# Altium schematic sheet Page-6.schdoc: PCIe-Addon
size 308 x 237 mm; CompanyName: InSYS; DrawnBy: NaveenKumar; Revision: 2.0; SheetNumber: 6; SheetTotal: 10; Title2: Gateway
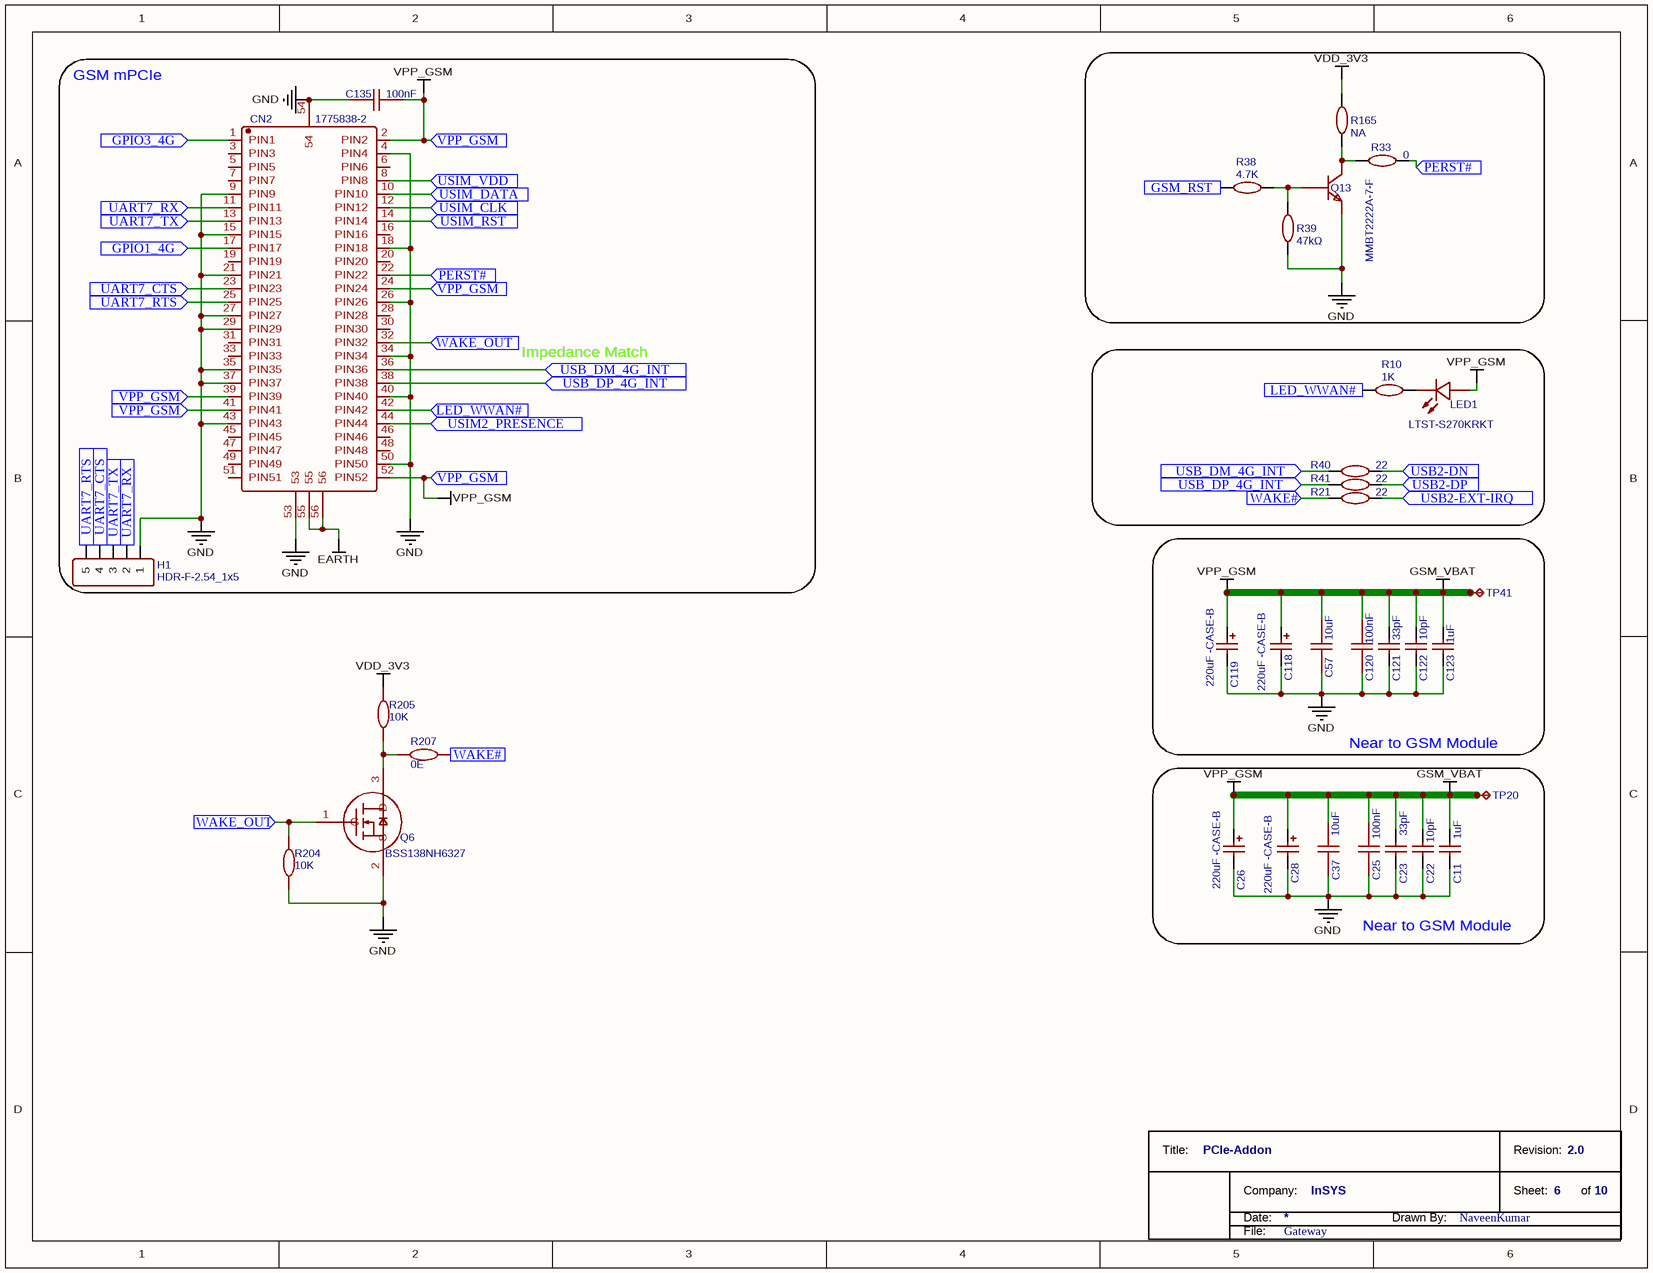
[diagram p0: Page-6.schdoc]

## Parts
*  TitleBlock_1  (value not drawn)  (graphical)
C11  1uF  [GWAY_Capacitor_0603]
C22  10pF  [GWAY_Capacitor_0603]
C23  33pF  [GWAY_Capacitor_0603]
C25  100nF  [GWAY_Capacitor_0603]
C26  220uF -CASE-B  [GWAY_CASE-B]
C28  220uF -CASE-B  [GWAY_CASE-B]
C37  10uF  [GWAY_Capacitor_0805]
C57  10uF  [GWAY_Capacitor_0603]
C118  220uF -CASE-B  [GWAY_CASE-B]
C119  220uF -CASE-B  [GWAY_CASE-B]
C120  100nF  [GWAY_Capacitor_0603]
C121  33pF  [GWAY_Capacitor_0603]
C122  10pF  [GWAY_Capacitor_0603]
C123  1uF  [GWAY_Capacitor_0603]
C135  100nF  [GWAY_Capacitor_0603]
CN2  1775838-2  [GWAY_TE_1775838-2_Full_Card]
H1  HDR-F-2.54_1x5  [GWAY_5way_HEADER_CONN]
LED1  LTST-S270KRKT  [GWAY_Led_WHITE_0603]
Q6  BSS138NH6327  [GWAY_SOT23-3PIN]
Q13  MMBT2222A-7-F  [GWAY_SOT23-3PIN]
R10  1K  [GWAY_Resistor_0603]
R21  22  [GWAY_Resistor_0603]
R33  0  [GWAY_Resistor_0603]
R38  4.7K  [GWAY_Resistor_0603]
R39  47kΩ  [GWAY_Resistor_0603]
R40  22  [GWAY_Resistor_0603]
R41  22  [GWAY_Resistor_0603]
R165  NA  [GWAY_Resistor_0603]
R204  10K  [GWAY_Resistor_0603]
R205  10K  [GWAY_Resistor_0603]
R207  0E  [GWAY_Resistor_0603]
TP20  TP-052-TJ  [GWAY_TESTPOINT1]  (value not drawn)
TP41  TP-052-TJ  [GWAY_TESTPOINT1]  (value not drawn)

## Blocks framed on the sheet
Near to GSM Module: C57 C118-C123 TP41

## Ports
GPIO1_4G (in), GPIO3_4G (in), GSM_RST (in), LED_WWAN# (in), PERST# (in), UART7_CTS (in), UART7_RTS (in), UART7_RX (in), UART7_TX (in), USB2-DN (in), USB2-DP (in), USB2-EXT-IRQ (in), USB_DM_4G_INT (in), USB_DP_4G_INT (in), USIM2_PRESENCE (in), USIM_CLK (in), USIM_DATA (in), USIM_RST (in), USIM_VDD (in), VPP_GSM (in), WAKE# (in), WAKE_OUT (in)

## Nets
EARTH: CN2.55 CN2.56
GND: C11.1 C22.1 C23.1 C25.2 C26.2 C28.2 C37.1 C57.1 C118.2 C119.2 C120.2 C121.1 C122.1 C123.1 C135.1 CN2.4(PIN4) CN2.9(PIN9) CN2.15(PIN15) CN2.18(PIN18) CN2.21(PIN21) CN2.26(PIN26) CN2.27(PIN27) CN2.29(PIN29) CN2.34(PIN34) CN2.35(PIN35) CN2.37(PIN37) CN2.40(PIN40) CN2.43(PIN43) CN2.50(PIN50) CN2.53 CN2.54 H1.1 Q6.2(S) Q13.2(E) R39.1 R204.2
GSM_VBAT: C11.2 C22.2 C23.2 C25.1 C26.1 C28.1 C37.2 C57.2 C118.1 C119.1 C120.1 C121.2 C122.2 C123.2 C135.2 CN2.2(PIN2) CN2.24(PIN24) CN2.39(PIN39) CN2.41(PIN41) CN2.52(PIN52) LED1.1(A) TP20.1 TP41.1 ; port VPP_GSM  [also labelled VPP_GSM]
VDD_3V3: R165.1 R205.1
GPIO1_4G: CN2.17(PIN17) ; port GPIO1_4G
GPIO3_4G: CN2.1(PIN1) ; port GPIO3_4G
GSM_RST: R38.2 ; port GSM_RST
LED_WWAN#: CN2.42(PIN42) R10.1 ; port LED_WWAN#
PERST#: CN2.22(PIN22) R33.2 ; port PERST#
UART7_CTS: CN2.23(PIN23) H1.4 ; port UART7_CTS
UART7_RTS: CN2.25(PIN25) H1.5 ; port UART7_RTS
UART7_RX: CN2.11(PIN11) H1.2 ; port UART7_RX
UART7_TX: CN2.13(PIN13) H1.3 ; port UART7_TX
USB2-DN: R40.2 ; port USB2-DN
USB2-DP: R41.2 ; port USB2-DP
USB2-EXT-IRQ: R21.2 ; port USB2-EXT-IRQ
USB_DM_4G_INT: CN2.36(PIN36) R40.1 ; port USB_DM_4G_INT
USB_DP_4G_INT: CN2.38(PIN38) R41.1 ; port USB_DP_4G_INT
USIM2_PRESENCE: CN2.44(PIN44) ; port USIM2_PRESENCE
USIM_CLK: CN2.12(PIN12) ; port USIM_CLK
USIM_DATA: CN2.10(PIN10) ; port USIM_DATA
USIM_RST: CN2.14(PIN14) ; port USIM_RST
USIM_VDD: CN2.8(PIN8) ; port USIM_VDD
WAKE#: R21.1 R207.2 ; port WAKE#
WAKE_OUT: CN2.32(PIN32) Q6.1(G) R204.1 ; port WAKE_OUT
NetLED1_2: LED1.2(K) R10.2
NetQ6_3: Q6.3(D) R205.2 R207.1
NetQ13_1: Q13.1(B) R38.1 R39.2
NetQ13_3: Q13.3(C) R33.1 R165.2

Not connected (* = marked no-connect by the designer): CN2 3(PIN3) 5(PIN5) 6(PIN6) 7(PIN7) 16(PIN16) 19(PIN19) 20(PIN20) 28(PIN28) 30(PIN30) 31(PIN31) 33(PIN33) 45(PIN45) 46(PIN46) 47(PIN47) 48(PIN48) 49(PIN49) 51(PIN51)

## Notes on the sheet
- GSM mPCIe
- Impedance Match
- Near to GSM Module
- (in symbol TitleBlock_1) Title:; Revision:; Company:; Sheet:; of; Date:; Drawn By:; File:

## Library data of the parts
* = TitleBlock_1: TitleBlock  No-2; TitleName: *; Company: *; Drawn By: *; File: *
C11 C123 = 1uF: Manufacturer Part: CL10A105KO8NNNC; Manufacturer: SAMSUNG; nameAlias: Capacitance; Supplier: LCSC; Supplier Part: C1592; spicePre: C; spiceSymbolName: CL10A105KO8NNNC
C22 C122 = 10pF: Manufacturer Part: CL10C100JB8NNNC; Manufacturer: SAMSUNG; nameAlias: Capacitance; SMT Type: Basic; Supplier: LCSC; LCSC Assembly: Yes; Supplier Part: C1634; spicePre: C; spiceSymbolName: CL10C100JB8NNNC
C23 C121 = 33pF: Manufacturer Part: CL10C330JB8NNNC; Manufacturer: SAMSUNG; nameAlias: Capacitance; SMT Type: Basic; Supplier: LCSC; LCSC Assembly: Yes; Supplier Part: C1663; spicePre: C; spiceSymbolName: CL10C330JB8NNNC
C25 C120 C135 = 100nF: Manufacturer: SAMSUNG; Manufacturer Part: CL10B104KB8NNNC; nameAlias: Capacitance; Supplier: LCSC; Supplier Part: C1591; spicePre: C; spiceSymbolName: CL10B104KB8NNNC
C26 C28 C118 C119 = 220uF -CASE-B: Manufacturer: PANASONIC; Manufacturer Part: 6TPE220MAZB; nameAlias: Capacitance; SMT Type: Extend; Supplier: LCSC; Supplier Part: C79111; LCSC Assembly: Yes; spicePre: C; spiceSymbolName: 6TPE220MAZB
C37 C57 = 10uF: Manufacturer: SAMSUNG(三星); Manufacturer Part: CL21B106KOQNNNE; nameAlias: Capacitance; Supplier: LCSC; Supplier Part: C95841; JLCPCB Part Class: Extended Part; spicePre: C; spiceSymbolName: CL21B106KOQNNNE
CN2 = PCIE Mini Full Card: Manufacturer: TE Connectivity; Contributor: LCSC; Supplier: LCSC; Manufacturer Part: 1775838-2; Supplier Part: C91936; spicePre: C; spiceSymbolName: 1775838-2
H1 = HDR-F-2.54_1x5: Contributor: LCEDA_Lib; Supplier Part: C50950; Supplier: LCSC; spicePre: H; spiceSymbolName: HDR-F-2.54_1x5
LED1 = LTST-S270KRKT: Manufacturer: LITEON; Manufacturer Part: LTW-C193TS5; Contributor: LCSC; Supplier: LCSC; Supplier Part: C115462; spicePre: L
Q6 = BSS138NH6327: Manufacturer: Infineon(英飞凌); Contributor: LCSC; Supplier: LCSC; Manufacturer Part: BSS138NH6327; Supplier Part: C94638; JLCPCB Part Class: Extended Part; spicePre: Q; spiceSymbolName: BSS138NH6327
Q13 = MMBT2222A-7-F: Manufacturer: DIODES(美台); Contributor: LCSC; Supplier: LCSC; Supplier Part: C94515; Manufacturer Part: MMBT2222A-7-F; JLCPCB Part Class: Extended Part; spicePre: Q; spiceSymbolName: MMBT2222A-7-F
R10 = 1K: Manufacturer Part: RC0603FR-071KL; Manufacturer: YAGEO; nameAlias: Resistance (Ohms); Supplier: LCSC; Supplier Part: C22548; spicePre: R; spiceSymbolName: RC0603FR-071KL
R21 R40 R41 = 22: Manufacturer: YAGEO; Manufacturer Part: RC0603FR-0722RL; nameAlias: Resistance (Ohms); Supplier: LCSC; Supplier Part: C107701; spicePre: R; spiceSymbolName: RC0603FR-0722RL
R33 = 0: Manufacturer: YAGEO; Manufacturer Part: RC0603FR-070RL; nameAlias: Resistance (Ohms); Supplier: LCSC; Supplier Part: C100044; spicePre: R; spiceSymbolName: RC0603FR-070RL
R38 = 4.7K: Manufacturer: YAGEO; Manufacturer Part: RC0603FR-074K7L; nameAlias: Resistance (Ohms); Supplier: LCSC; Supplier Part: C99782; spicePre: R; spiceSymbolName: RC0603FR-074K7L
R39 = 47kΩ: Manufacturer: YAGEO(国巨); nameAlias: Value; Supplier: LCSC; Supplier Part: C105579; JLCPCB Part Class: Extended Part; spicePre: R; spiceSymbolName: RC0603FR-0747KL
R165 = NA: Manufacturer: YAGEO; Manufacturer Part: RC0603FR-074K7L; nameAlias: Resistance (Ohms); Supplier: LCSC; Supplier Part: C99782; spicePre: R; spiceSymbolName: RC0603FR-074K7L
R204 R205 R207 = 100K: Manufacturer: YAGEO; Manufacturer Part: RC0603FR-07100KL; nameAlias: Resistance (Ohms); Contributor: LCSC; Supplier: LCSC; Supplier Part: C14675; spicePre: R; spiceSymbolName: RC0603FR-07100KL
TP20 TP41 = TP-052-TJ: Manufacturer Part: ?; spicePre: T